# Altium project Open_Rally_Computer.PrjPCB
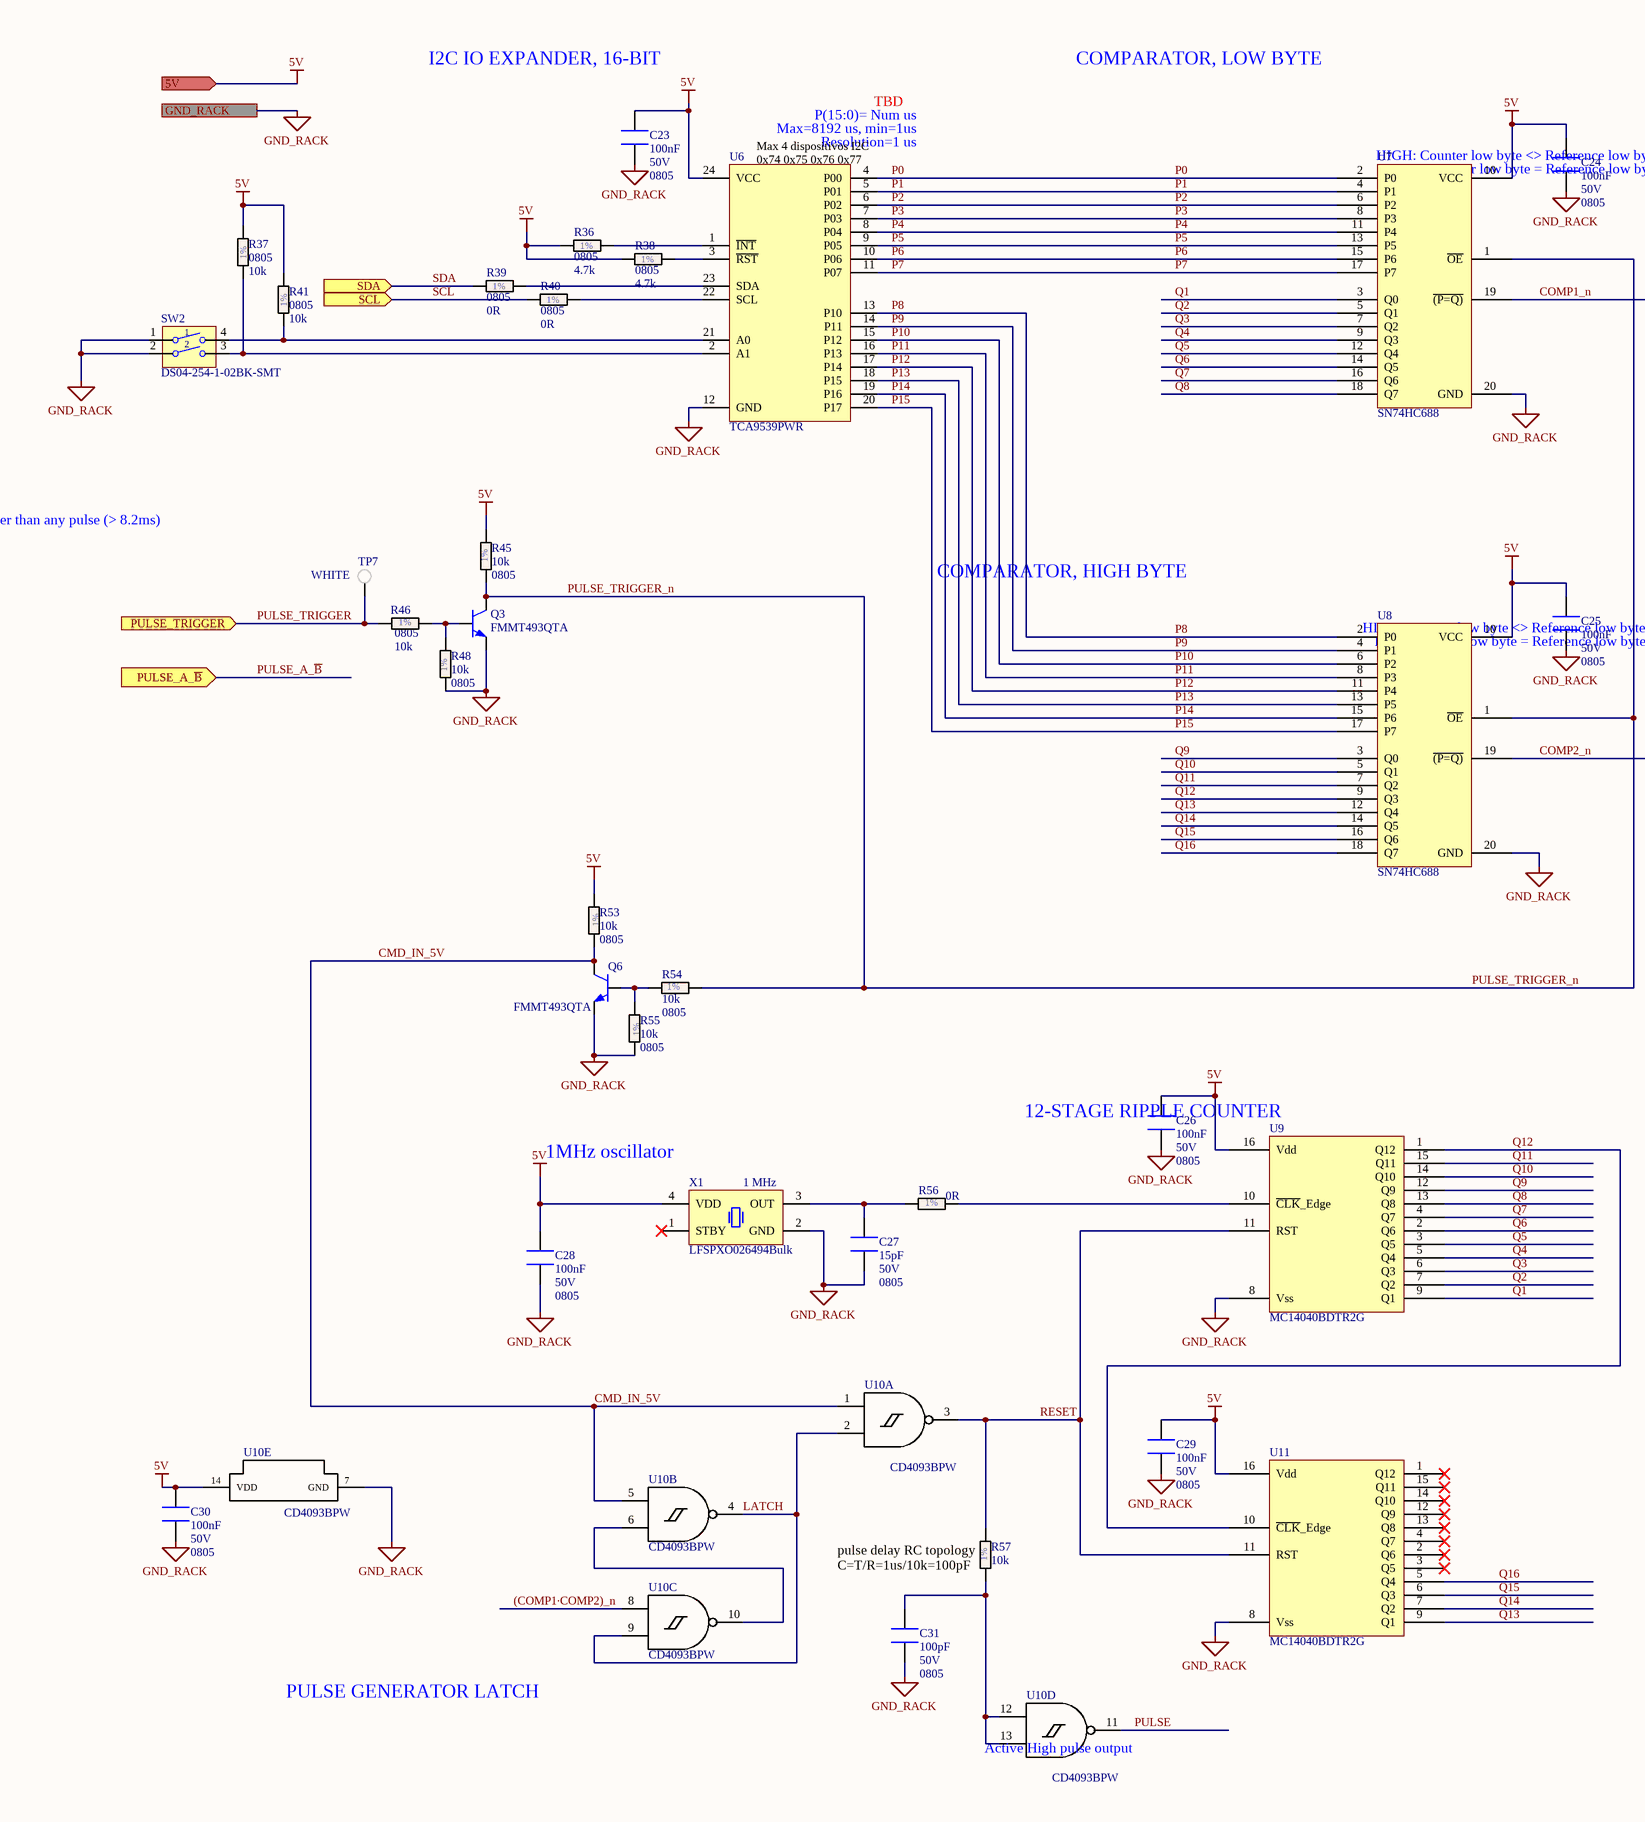
[diagram p0: ProgrammablePulseGenerator.SchDoc, left]
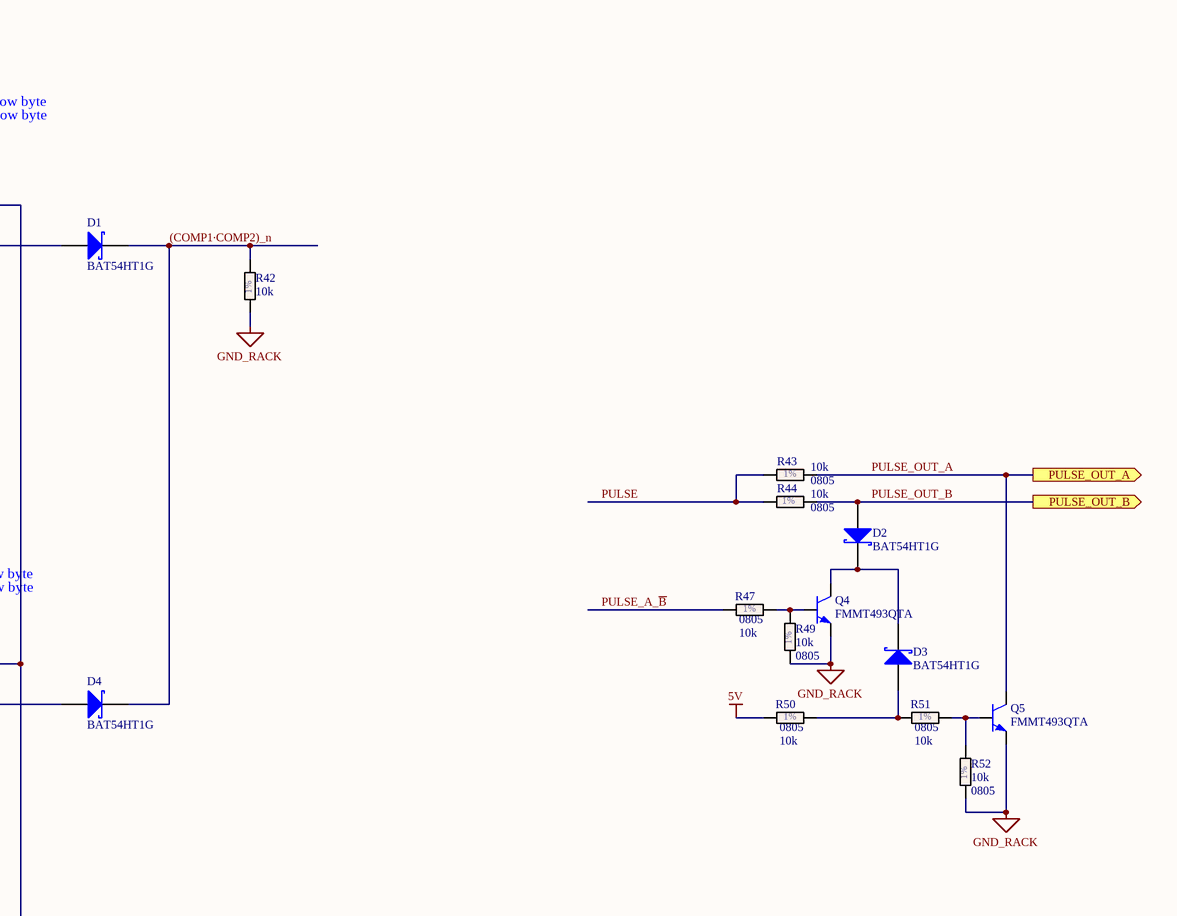
[diagram p1: ProgrammablePulseGenerator.SchDoc, right]
Date1: 31/3/23; DesignedBy1: J.A. SERRANO; Title1: HALO; Title2: ETHERNET_I2C
1 sheet, 49 parts. Net scope: strictly hierarchical (ports join the sheet entries above them; power ports are local).
Board file: ETH-I2C.PcbDoc

## Sheet ProgrammablePulseGenerator.SchDoc
size A2; DocumentNumber: 5; SheetNumber: 5; SheetTotal: 5

### Parts
?  (no value)  (graphical)
C23  value 100nF  Voltage: 50V  Case: 0805  [C0805]  (hidden comment: CAP_CERAMIC_0805)
C24  value 100nF  Voltage: 50V  Case: 0805  [C0805]  (hidden comment: CAP_CERAMIC_0805)
C25  value 100nF  Voltage: 50V  Case: 0805  [C0805]  (hidden comment: CAP_CERAMIC_0805)
C26  value 100nF  Voltage: 50V  Case: 0805  [C0805]  (hidden comment: CAP_CERAMIC_0805)
C27  value 15pF  Voltage: 50V  Case: 0805  [C0805]  (hidden comment: CAP_CERAMIC_0805)
C28  value 100nF  Voltage: 50V  Case: 0805  [C0805]  (hidden comment: CAP_CERAMIC_0805)
C29  value 100nF  Voltage: 50V  Case: 0805  [C0805]  (hidden comment: CAP_CERAMIC_0805)
C30  value 100nF  Voltage: 50V  Case: 0805  [C0805]  (hidden comment: CAP_CERAMIC_0805)
C31  value 100pF  Voltage: 50V  Case: 0805  [C0805]  (hidden comment: CAP_CERAMIC_0805)
D1  BAT54HT1G  [SOD323]
D2  BAT54HT1G  [SOD323]
D3  BAT54HT1G  [SOD323]
D4  BAT54HT1G  [SOD323]
Q3  FMMT493QTA  [SOT-23]
Q4  FMMT493QTA  [SOT-23]
Q5  FMMT493QTA  [SOT-23]
Q6  FMMT493QTA  [SOT-23]
R36  value 4.7k  Case: 0805  Tolerance: 1%  [R0805]  (hidden comment: RES_0805)
R37  value 10k  Case: 0805  Tolerance: 1%  [R0805]  (hidden comment: RES_0805)
R38  value 4.7k  Case: 0805  Tolerance: 1%  [R0805]  (hidden comment: RES_0805)
R39  value 0R  Case: 0805  Tolerance: 1%  [R0805]  (hidden comment: RES_0805)
R40  value 0R  Case: 0805  Tolerance: 1%  [R0805]  (hidden comment: RES_0805)
R41  value 10k  Case: 0805  Tolerance: 1%  [R0805]  (hidden comment: RES_0805)
R42  value 10k  Tolerance: 1%  [R0805]  (hidden comment: RES_0805)
R43  value 10k  Case: 0805  Tolerance: 1%  [R0805]  (hidden comment: RES_0805)
R44  value 10k  Case: 0805  Tolerance: 1%  [R0805]  (hidden comment: RES_0805)
R45  value 10k  Case: 0805  Tolerance: 1%  [R0805]  (hidden comment: RES_0805)
R46  value 10k  Case: 0805  Tolerance: 1%  [R0805]  (hidden comment: RES_0805)
R47  value 10k  Case: 0805  Tolerance: 1%  [R0805]  (hidden comment: RES_0805)
R48  value 10k  Case: 0805  Tolerance: 1%  [R0805]  (hidden comment: RES_0805)
R49  value 10k  Case: 0805  Tolerance: 1%  [R0805]  (hidden comment: RES_0805)
R50  value 10k  Case: 0805  Tolerance: 1%  [R0805]  (hidden comment: RES_0805)
R51  value 10k  Case: 0805  Tolerance: 1%  [R0805]  (hidden comment: RES_0805)
R52  value 10k  Case: 0805  Tolerance: 1%  [R0805]  (hidden comment: RES_0805)
R53  value 10k  Case: 0805  Tolerance: 1%  [R0805]  (hidden comment: RES_0805)
R54  value 10k  Case: 0805  Tolerance: 1%  [R0805]  (hidden comment: RES_0805)
R55  value 10k  Case: 0805  Tolerance: 1%  [R0805]  (hidden comment: RES_0805)
R56  value 0R  Tolerance: 1%  [R0805]  (hidden comment: RES_0805)
R57  value 10k  Tolerance: 1%  [R0805]  (hidden comment: RES_0805)
SW2  DS04-254-1-02BK-SMT  [DS04-254-1-02BK-SMT]
TP7  value WHITE  [TEST_POINT_WHITE-LARGE]  (hidden comment: TEST_POINT)
U6  TCA9539PWR  [TSSOP24]
U7  SN74HC688  [TSSOP20]
U8  SN74HC688  [TSSOP20]
U9  MC14040BDTR2G  [TSSOP-16N]
U10  CD4093BPW  [TSSOP-14]  (parts A,B,C,D,E of 5)
U11  MC14040BDTR2G  [TSSOP-16N]
X1  1 MHz  [LFSPXO026494Bulk]

### Ports
5V (in), GND_RACK, PULSE_A_~{B} (in), PULSE_OUT_A (out), PULSE_OUT_B (out), PULSE_TRIGGER (in), SCL (in), SDA (in)

### Nets
5V: C23.2 C24.2 C25.2 C26.2 C28.2 C29.2 C30.2 R36.1 R37.1 R38.1 R41.1 R45.1 R50.1 R53.1 U6.24(VCC) U7.10(VCC) U8.10(VCC) U9.16(Vdd) U10.14(VDD) U11.16(Vdd) X1.4(VDD) ; port 5V
GND_RACK: C23.1 C24.1 C25.1 C26.1 C27.1 C28.1 C29.1 C30.1 C31.1 Q3.2(E) Q4.2(E) Q5.2(E) Q6.2(E) R42.1 R48.1 R49.1 R52.1 R55.1 SW2.1 SW2.2 U6.12(GND) U7.20(GND) U8.20(GND) U9.8(Vss) U10.7(GND) U11.8(Vss) X1.2(GND) ; port GND_RACK
(COMP1·COMP2)_n: D1.1(K) D4.1(K) R42.2 U10.8(E)
CMD_IN_5V: Q6.3(C) R53.2 U10.1(A) U10.5(C)
COMP1_n: D1.2(A) U7.19(~{(P=Q)})
COMP2_n: D4.2(A) U8.19(~{(P=Q)})
LATCH: U10.2(B) U10.4(K) U10.9(F)
P0: U6.4(P00) U7.2(P0)
P1: U6.5(P01) U7.4(P1)
P2: U6.6(P02) U7.6(P2)
P3: U6.7(P03) U7.8(P3)
P4: U6.8(P04) U7.11(P4)
P5: U6.9(P05) U7.13(P5)
P6: U6.10(P06) U7.15(P6)
P7: U6.11(P07) U7.17(P7)
P8: U6.13(P10) U8.2(P0)
P9: U6.14(P11) U8.4(P1)
P10: U6.15(P12) U8.6(P2)
P11: U6.16(P13) U8.8(P3)
P12: U6.17(P14) U8.11(P4)
P13: U6.18(P15) U8.13(P5)
P14: U6.19(P16) U8.15(P6)
P15: U6.20(P17) U8.17(P7)
PULSE: R43.1 R44.1 U10.11(M)
PULSE_A_~{B}: R47.1 ; port PULSE_A_~{B}
PULSE_OUT_A: Q5.3(C) R43.2 ; port PULSE_OUT_A
PULSE_OUT_B: D2.2(A) R44.2 ; port PULSE_OUT_B
PULSE_TRIGGER: R46.1 TP7.1 ; port PULSE_TRIGGER
PULSE_TRIGGER_n: Q3.3(C) R45.2 R54.1 U7.1(~{OE}) U8.1(~{OE})
Q1: U7.3(Q0) U9.9(Q1)
Q2: U7.5(Q1) U9.7(Q2)
Q3: U7.7(Q2) U9.6(Q3)
Q4: U7.9(Q3) U9.5(Q4)
Q5: U7.12(Q4) U9.3(Q5)
Q6: U7.14(Q5) U9.2(Q6)
Q7: U7.16(Q6) U9.4(Q7)
Q8: U7.18(Q7) U9.13(Q8)
Q9: U8.3(Q0) U9.12(Q9)
Q10: U8.5(Q1) U9.14(Q10)
Q11: U8.7(Q2) U9.15(Q11)
Q12: U8.9(Q3) U9.1(Q12) U11.10(~{CLK}_Edge)
Q13: U8.12(Q4) U11.9(Q1)
Q14: U8.14(Q5) U11.7(Q2)
Q15: U8.16(Q6) U11.6(Q3)
Q16: U8.18(Q7) U11.5(Q4)
RESET: R57.1 U9.11(RST) U10.3(J) U11.11(RST)
SCL: R40.1 ; port SCL
SDA: R39.1 ; port SDA
NetC27_2: C27.2 R56.2 X1.3(OUT)
NetC31_2: C31.2 R57.2 U10.12(G) U10.13(H)
NetD2_1: D2.1(K) D3.1(K) Q4.3(C)
NetD3_2: D3.2(A) R50.2 R51.1
NetQ3_1: Q3.1(B) R46.2 R48.2
NetQ4_1: Q4.1(B) R47.2 R49.2
NetQ5_1: Q5.1(B) R51.2 R52.2
NetQ6_1: Q6.1(B) R54.2 R55.2
NetR36_2: R36.2 U6.1(~{INT})
NetR37_2: R37.2 SW2.3 U6.2(A1)
NetR38_2: R38.2 U6.3(~{RST})
NetR39_2: R39.2 U6.23(SDA)
NetR40_2: R40.2 U6.22(SCL)
NetR41_2: R41.2 SW2.4 U6.21(A0)
NetR56_1: R56.1 U9.10(~{CLK}_Edge)
NetU10_6: U10.6(D) U10.10(L)

Not connected (* = marked no-connect by the designer): U11 1(Q12)* 2(Q6)* 3(Q5)* 4(Q7)* 12(Q9)* 13(Q8)* 14(Q10)* 15(Q11)*; X1 1(STBY)*

### Notes on the sheet
- I2C IO EXPANDER, 16-BIT
- TBD
- COMPARATOR, LOW BYTE
- (near U6) Max 4 dispositivos I2C
  0x74 0x75 0x76 0x77
- P(15:0)= Num us
- Resolution=1 us
- Max=8192 us, min=1us
- HIGH: Counter low byte <> Reference low byte
- LOW: Counter low byte = Reference low byte
- (near R45) CMD_IN must last longer than any pulse (> 8.2ms)
- COMPARATOR, HIGH BYTE
- (near U9) 12-STAGE RIPPLE COUNTER
- (near X1) 1MHz oscillator
- (near R57) pulse delay RC topology
  C=T/R=1us/10k=100pF
- (near U10) PULSE GENERATOR LATCH
- (near U10) Active High pulse output
- 1
- BASELINE
- VERSION
- ISSUE
- SHEET
- DESCRIPTION
- C.C.
- DATE
- NAME
- SIGNATURE
- ALTIUM
- PAT
- NEXT ASSY:
- of
- DESIGNED
- CAD
- TITLE
- CHECKED
- APPROVED
- AUTHORIZED
- ACCEPTED
- The contents of this document are the property of Computadoras, Redes e Ingeniería,
  S.A. (CRISA), Madrid and must not be copied, reproduced or disclosed, total or partially,
  to a third party, without written authorization.

### Library data of the parts
? = CRISA_Schematic_Title Blocks
C23-C31 = CAP_CERAMIC_0805: Capacitor Ceramic 0805 No Polarized; 01_Type: CAPACITOR; 02_Generic Part Number: *; 03_Part Number: *; 04_Manufacturer: *; 05_RS Part Number: *; 06_Farnell Part Number: *; 07_Mouser Part Number: *; 08_Digi-Key Part Number: *; 09_helpURL: *; Check Footprint: NO; Check Symbol: NO
D1-D4 = BAT54H: BAT54H, Schottky diode, 30v, 200mA SOD323; 03_Part Number: NSVBAT54HT1G; 04_Manufacturer: onsemi; Check Footprint: NO; 01_Type: DIODE; 02_Generic Part Number: BAT54H; 07_Mouser Part Number: 863-NSVBAT54HT1G; Case: SOD323; Check Symbol: NO; Value: BAT54HT1G
Q3-Q6 = FMMT493QTA: Transistores bipolares - BJT 100V NPN Med PWR 1A Ic 2A Icm 500mW; 04_Manufacturer: Diodes Incorporated; 01_Type: BJT-P; Check Footprint: NO; 03_Part Number: FMMT493QTA; 07_Mouser Part Number: 621-FMMT493QTA; Value: FMMT493QTA; Check Symbol: NO
R36-R57 = RES_0805: Resistor 0805; Check Footprint: NO; 01_Type: RESISTOR; 02_Generic Part Number: *; 05_RS Part Number: *; 06_Farnell Part Number: *; 08_Digi-Key Part Number: *; 09_helpURL: *; Power: *; Check Symbol: NO
  R36-R41: 03_Part Number: *; 04_Manufacturer: *; 07_Mouser Part Number: *
  R42 R56 R57: Case: 0805
SW2 = SW 2x SPST Raised: SIP DIP Switch, SPST, 2.54 pitch, Raised actuator, SMT, 2 position, Blac; 04_Manufacturer: CUI Devices; Check Footprint: NO; 01_Type: SWITCH; 02_Generic Part Number: *; 03_Part Number: DS04-254-1-02BK-SMT; 05_RS Part Number: *; 06_Farnell Part Number: *; 07_Mouser Part Number: *; 08_Digi-Key Part Number: 2223-DS04-254-1-02BK-SMT-ND; 09_helpURL: https://www.digikey.es/es/products/detail/cui-devices/DS04-254-1-02BK-SMT/11310930?s=N4IgTCBcDaICIGUAMAWAtGArOgjGpYAQgNJoICyAKiALoC%2BQA; Value: DS04-254-1-02BK-SMT; Check Symbol: NO
TP7 = TEST_POINT_WHITE_LARGE: White Pin for 2.4mm PCB Thickness (1.8mm Hole); 03_Part Number: 5012; 04_Manufacturer: Keystone; 01_Type: Test Terminal; Check Footprint: NO; 05_RS Part Number: *; 06_Farnell Part Number: *; 07_Mouser Part Number: *; 02_Generic Part Number: *; 09_helpURL: https://www.digikey.es/es/products/detail/keystone-electronics/5012/255334; 08_Digi-Key Part Number: 36-5012-ND; Check Symbol: NO
U6 = TCA9539: Interfaz. Extensores de E/S Rem 16B I2C & SMBus Low-Pwr I/O Expander; 04_Manufacturer: Texas Instruments; 01_Type: IC; Check Footprint: NO; Check Symbol: SI; 02_Generic Part Number: TCA9539; 03_Part Number: TCA9539PWR; 07_Mouser Part Number: 595-TCA9539PWR; Case: TSSOP24; Value: TCA9539PWR
U7 U8 = SN74HC688: 8-bit identity comparator; 03_Part Number: SN74HC688PWR; 01_Type: IC; Check Footprint: NO; 02_Generic Part Number: SN74HC688; 07_Mouser Part Number: 595-SN74HC688PWR; Case: TSSOP20; Check Symbol: NO; Value: SN74HC688
U9 U11 = MC14040B: Registros de desplazamientos de contadores 3-18V 12-Bit Binary; 04_Manufacturer: onsemi; 01_Type: IC; Check Footprint: NO; Check Symbol: SI; 02_Generic Part Number: MC14040; 03_Part Number: MC14040BDTR2G; 07_Mouser Part Number: 863-MC14040BDTR2G; Case: TSSOP16; Value: MC14040BDTR2G
U10 = CD4093BPW: NAND Gate IC 4 Channel 14-TSSOP; 04_Manufacturer: Texas Instruments; Check Footprint: NO; Value: CD4093BPW; 01_Type: IC; 02_Generic Part Number: *; 03_Part Number: CD4093BPW; 05_RS Part Number: *; 06_Farnell Part Number: *; 07_Mouser Part Number: *; 08_Digi-Key Part Number: 296-14146-5-ND; 09_helpURL: https://www.digikey.es/es/products/detail/texas-instruments/CD4093BPW/525964; Check Symbol: NO
X1 = LFSPXO026494Bulk: Osciladores de reloj estándar 1MHz 5V 50ppm 0C +70C; 04_Manufacturer: IQD; 01_Type: IC; Check Footprint: SI; 02_Generic Part Number: LFSPXO026494Bulk; 03_Part Number: LFSPXO026494Bulk; 05_RS Part Number: *; 06_Farnell Part Number: *; 07_Mouser Part Number: 449-LFSPXO026494BULK; 08_Digi-Key Part Number: *; 09_helpURL: *; Value: 1 MHz; Check Symbol: SI